# Altium schematic sheet 3V3_Block.SchDoc
size A4; CheckedBy: CT-Energys; Author: CT-Energys; CompanyName: HTD COMPANY LIMITED; DrawnBy: CHITOAN; Engineer: CHITOAN; Organization: Altium Limited; Address1: HO CHI MINH CITY; Address2: VIETNAM
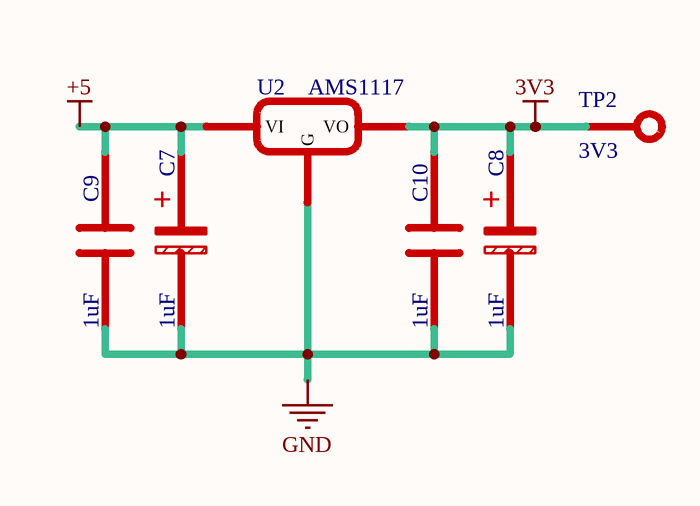
[diagram p0: 3V3_Block.SchDoc]

## Parts
C7  1uF  [CAP-AL-4x5.4]
C8  1uF  [CAP-AL-4x5.4]
C9  1uF  [C0805]
C10  1uF  [C0805]
TP2  3V3  [Test Point]
U2  AMS1117  [SOT-223]

## Nets
3V3: C8.1 C10.2 TP2.1 U2.2(VO)
+5: C7.1 C9.2 U2.3(VI)
GND: C7.2 C8.2 C9.1 C10.1 U2.1(G)

## Notes on the sheet
- Title
- Size:
- Date:
- A4
- Number:
- Time:
- Revision:
- Design by:
- Company:
- File:
- (in symbol CAP-ALU) +

## Library data of the parts
C7 C8 = CAP-ALU: Aluminum Capacitor
C9 C10 = CAP-CER: Ceramic Capacitor
TP2 = TestPoint: Test Point
U2 = AMS1117: Regulator intergated chip; pin to pad: 4>2; ComponentLink1Description: AMS1117-3.3; ComponentLink1URL: https://mm.digikey.com/Volume0/opasdata/d220001/medias/docus/6283/AMS1117-2.5.pdf